# Altium schematic sheet Logic.SchDoc
size A
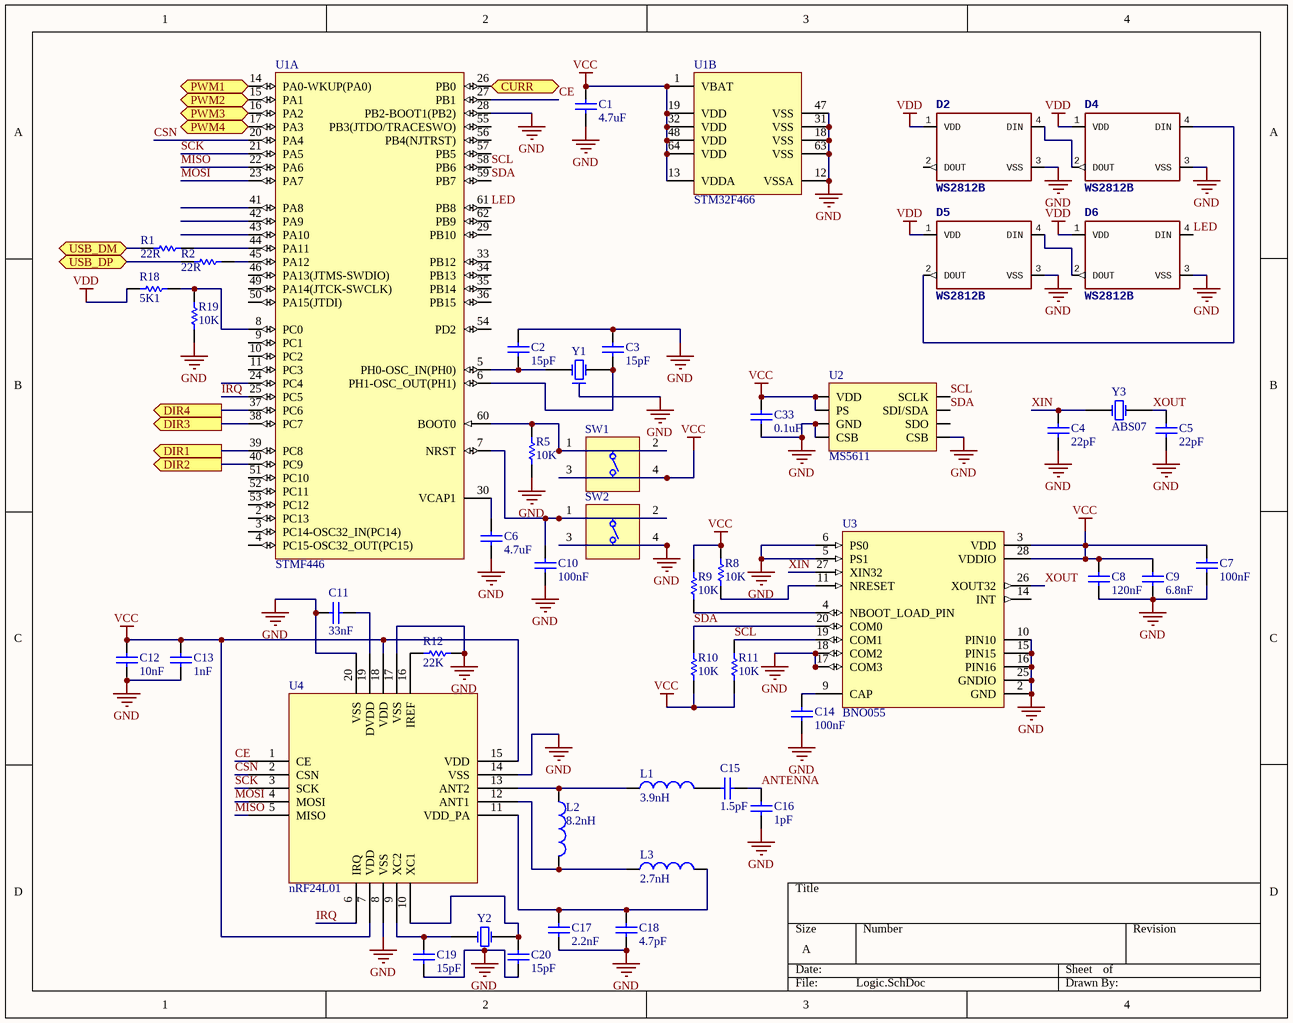
[diagram p0: Logic.SchDoc]

## Parts
C1  4.7uF  [CAPC0402(1005)60_L]
C2  15pF  [CAPC0402(1005)60_M]
C3  15pF  [CAPC0402(1005)60_M]
C4  22pF  [CAPC0402(1005)60_L]
C5  22pF  [CAPC0402(1005)60_L]
C6  4.7uF  [CAPC0402(1005)60_L]
C7  100nF  [CAPC0402(1005)60_M]
C8  120nF  [CAPC0402(1005)60_M]
C9  6.8nF  [CAPC0402(1005)60_L]
C10  100nF  [CAPC0402(1005)60_M]
C11  33nF  [CAPC0402(1005)60_M]
C12  10nF  [CAPC0402(1005)60_M]
C13  1nF  [CAPC0402(1005)60_M]
C14  100nF  [CAPC0402(1005)60_M]
C15  1.5pF  [CAPC0402(1005)60_L]
C16  1pF  [CAPC0402(1005)60_M]
C17  2.2nF  [CAPC0402(1005)60_N]
C18  4.7pF  [CAPC0402(1005)60_M]
C19  15pF  [CAPC0402(1005)60_N]
C20  15pF  [CAPC0402(1005)60_N]
C33  0.1uF  [CAPC0402(1005)60_M]
D2  WS2812B  [WS2812B]
D4  WS2812B  [WS2812B]
D5  WS2812B  [WS2812B]
D6  WS2812B  [WS2812B]
L1  3.9nH  [INDC0402(1005)_N]
L2  8.2nH  [INDC0402(1005)_N]
L3  2.7nH  [INDC0402(1005)_N]
R1  22R  [RESC0402(1005)_M]
R2  22R  [RESC0402(1005)_M]
R5  10K  [RESC0402(1005)_N]
R8  10K  [RESC0402(1005)_N]
R9  10K  [RESC0402(1005)_N]
R10  10K  [RESC0402(1005)_N]
R11  10K  [RESC0402(1005)_N]
R12  22K  [RESC0402(1005)_L]
R18  5K1  [RESC0402(1005)_L]
R19  10K  [RESC0402(1005)_N]
SW1  (no value)  [SWITCH]
SW2  (no value)  [SWITCH]
U1  STMF446  [STM-LQFP64_N]  (parts A,B of 2)
U2  MS5611  [MS5611]
U3  BNO055  [LGA28R50P4X10_380X520X100]
U4  (no value)  [QFN20]
Y1  (no value)  [ABRA-ABM3B-4_V]
Y2  (no value)  [ABRA-ABM3B-4_V]
Y3  ABS07  [ABS07]

## Ports
CURR (in), DIR1 (out), DIR2 (out), DIR3 (out), DIR4 (out), PWM1 (out), PWM2 (out), PWM3 (out), PWM4 (out), USB_DM (bidir), USB_DP (bidir)

## Nets
GND: C1.1 C2.2 C3.2 C4.1 C5.1 C6.1 C7.1 C8.1 C9.1 C10.1 C11.1 C12.1 C13.1 C14.1 C16.1 C17.1 C18.1 C19.1 C20.1 C33.1 D2.3(VSS) D4.3(VSS) D5.3(VSS) D6.3(VSS) R5.1 R12.1 R19.1 SW2.3(T3) SW2.4(T3) U1.12(VSSA) U1.18(VSS) U1.28(PB2-BOOT1(PB2)) U1.31(VSS) U1.47(VSS) U1.63(VSS) U2.3(GND) U2.4(CSB) U2.5(CSB) U3.2(GND) U3.5(PS1) U3.6(PS0) U3.10(PIN10) U3.15(PIN15) U3.16(PIN16) U3.17(COM3) U3.18(COM2) U3.25(GNDIO) U4.8(VSS) U4.14(VSS) U4.17(VSS) U4.20(VSS) Y1.2 Y2.2
VCC: C1.2 C7.2 C8.2 C9.2 C12.2 C13.2 C33.2 R8.2 R9.2 R10.1 R11.1 SW1.3(T3) SW1.4(T3) U1.1(VBAT) U1.13(VDDA) U1.19(VDD) U1.32(VDD) U1.48(VDD) U1.64(VDD) U2.1(VDD) U2.2(PS) U3.3(VDD) U3.28(VDDIO) U4.7(VDD) U4.15(VDD) U4.18(VDD)
VDD: D2.1(VDD) D4.1(VDD) D5.1(VDD) D6.1(VDD) R18.2
ANTENNA: C15.2 C16.2
CE: U1.27(PB1) U4.1(CE)
CSN: U1.20(PA4) U4.2(CSN)
CURR: U1.26(PB0) ; port CURR
DIR1: U1.39(PC8) ; port DIR1
DIR2: U1.40(PC9) ; port DIR2
DIR3: U1.38(PC7) ; port DIR3
DIR4: U1.37(PC6) ; port DIR4
IRQ: U1.25(PC5) U4.6(IRQ)
LED: D6.4(DIN) U1.61(PB8)
MISO: U1.22(PA6) U4.5(MISO)
MOSI: U1.23(PA7) U4.4(MOSI)
PWM1: U1.14(PA0-WKUP(PA0)) ; port PWM1
PWM2: U1.15(PA1) ; port PWM2
PWM3: U1.16(PA2) ; port PWM3
PWM4: U1.17(PA3) ; port PWM4
SCK: U1.21(PA5) U4.3(SCK)
SCL: R11.2 U1.58(PB6) U2.8(SCLK) U3.19(COM1)
SDA: R10.2 U1.59(PB7) U2.7(SDI/SDA) U3.20(COM0)
USB_DM: R1.1 ; port USB_DM
USB_DP: R2.1 ; port USB_DP
XIN: C4.2 U3.27(XIN32) Y3.1(X1)
XOUT: C5.2 U3.26(XOUT32) Y3.2(X2)
NetC2_1: C2.1 U1.5(PH0-OSC_IN(PH0)) Y1.1(X1)
NetC3_1: C3.1 U1.6(PH1-OSC_OUT(PH1)) Y1.3(X2)
NetC6_2: C6.2 U1.30(VCAP1)
NetC10_2: C10.2 SW2.1(T1) SW2.2(T2) U1.7(NRST)
NetC11_2: C11.2 U4.19(DVDD)
NetC14_2: C14.2 U3.9(CAP)
NetC15_1: C15.1 L1.2
NetC17_2: C17.2 C18.2 L3.2 U4.11(VDD_PA)
NetC19_2: C19.2 U4.9(XC2) Y2.1(X1)
NetC20_2: C20.2 U4.10(XC1) Y2.3(X2)
NetD2_4: D2.4(DIN) D4.2(DOUT)
NetD4_4: D4.4(DIN) D5.2(DOUT)
NetD5_4: D5.4(DIN) D6.2(DOUT)
NetL1_1: L1.1 L2.1 U4.13(ANT2)
NetL2_2: L2.2 L3.1 U4.12(ANT1)
NetR1_2: R1.2 U1.44(PA11)
NetR2_2: R2.2 U1.45(PA12)
NetR5_2: R5.2 SW1.1(T1) SW1.2(T2) U1.60(BOOT0)
NetR8_1: R8.1 U3.11(NRESET)
NetR9_1: R9.1 U3.4(NBOOT_LOAD_PIN)
NetR12_2: R12.2 U4.16(IREF)
NetR18_1: R18.1 R19.2 U1.8(PC0)

Not connected (* = marked no-connect by the designer): D2 2(DOUT); U1 2(PC13) 3(PC14-OSC32_IN(PC14)) 4(PC15-OSC32_OUT(PC15)) 9(PC1) 10(PC2) 11(PC3) 24(PC4) 29(PB10) 33(PB12) 34(PB13) 35(PB14) 36(PB15) 41(PA8) 42(PA9) 43(PA10) 46(PA13(JTMS-SWDIO)) 49(PA14(JTCK-SWCLK)) 50(PA15(JTDI)) 51(PC10) 52(PC11) 53(PC12) 54(PD2) 55(PB3(JTDO/TRACESWO)) 56(PB4(NJTRST)) 57(PB5) 62(PB9); U2 6(SDO); U3 14(INT)

## Notes on the sheet
- (in symbol NRF24L01+) nRF24L01

## Library data of the parts
C1 C6 = CMP-1034-02136-1: CAP 4.7uF 6.3V ±10% 0402 (1005 Metric) Thickness 0.6mm SMD; Case-EIA: 0402; Tolerance: Â±10%; Case-Metric: 1005; Technology: SMT; Value: 4.7uF; Max Thickness: 0.6 mm; Rated Voltage: 6.3 V
C2 C3 = CMP-1034-00804-1: CAP 15pF 25V ±0.25pF 0402 (1005 Metric) Thickness 0.6mm SMD; Case-EIA: 0402; Tolerance: Â±0.25pF; Case-Metric: 1005; Rated Voltage: 25 V; Max Thickness: 0.6 mm; Value: 15pF; Technology: SMT
C4 C5 = CMP-1034-00911-1: CAP 22pF 25V ±10% 0402 (1005 Metric) Thickness 0.6mm SMD; Case-Metric: 1005; Case-EIA: 0402; Tolerance: Â±10%; Technology: SMT; Max Thickness: 0.6 mm; Rated Voltage: 25 V; Value: 22pF
C7 C8 C10 C14 C33 = CMP-1034-02060-1: CAP 100nF 6.3V ±5% 0402 (1005 Metric) Thickness 0.6mm SMD; Case-EIA: 0402; Tolerance: Â±5%; Case-Metric: 1005; Rated Voltage: 6.3 V; Max Thickness: 0.6 mm; Value: 100nF; Technology: SMT
C9 = CMP-1034-01836-1: CAP 6.8nF 6.3V ±5% 0402 (1005 Metric) Thickness 0.6mm SMD; Case-EIA: 0402; Tolerance: Â±5%; Case-Metric: 1005; Max Thickness: 0.6 mm; Rated Voltage: 6.3 V; Value: 6.8nF; Technology: SMT
C11 = CMP-1034-01977-1: CAP 33nF 6.3V ±10% 0402 (1005 Metric) Thickness 0.6mm SMD; Tolerance: Â±10%; Case-Metric: 1005; Case-EIA: 0402; Technology: SMT; Rated Voltage: 6.3 V; Max Thickness: 0.6 mm; Value: 33nF
C12 = CMP-1034-01867-1: CAP 10nF 6.3V ±5% 0402 (1005 Metric) Thickness 0.6mm SMD; Case-EIA: 0402; Case-Metric: 1005; Tolerance: Â±5%; Technology: SMT; Rated Voltage: 6.3 V; Max Thickness: 0.6 mm; Value: 10nF
C13 = CMP-1034-01609-1: CAP 1nF 6.3V ±5% 0402 (1005 Metric) Thickness 0.6mm SMD; Case-EIA: 0402; Tolerance: Â±5%; Case-Metric: 1005; Rated Voltage: 6.3 V; Value: 1nF; Technology: SMT; Max Thickness: 0.6 mm
C15 = CMP-1034-00110-1: CAP 1.5pF 25V ±0.5pF 0402 (1005 Metric) Thickness 0.6mm SMD; Case-EIA: 0402; Case-Metric: 1005; Tolerance: Â±0.5pF; Max Thickness: 0.6 mm; Technology: SMT; Value: 1.5pF; Rated Voltage: 25 V
C16 = CMP-1034-00055-1: CAP 1pF 25V ±0.5pF 0402 (1005 Metric) Thickness 0.6mm SMD; Case-Metric: 1005; Tolerance: Â±0.5pF; Case-EIA: 0402; Value: 1pF; Rated Voltage: 25 V; Technology: SMT; Max Thickness: 0.6 mm
C17 = CMP-1034-01722-1: CAP 2.2nF 6.3V ±5% 0402 (1005 Metric) Thickness 0.6mm SMD; Tolerance: Â±5%; Case-EIA: 0402; Case-Metric: 1005; Max Thickness: 0.6 mm; Technology: SMT; Rated Voltage: 6.3 V; Value: 2.2nF
C18 = CMP-1034-00362-1: CAP 4.7pF 25V ±0.1pF 0402 (1005 Metric) Thickness 0.6mm SMD; Case-EIA: 0402; Case-Metric: 1005; Tolerance: Â±0.1pF; Max Thickness: 0.6 mm; Value: 4.7pF; Technology: SMT; Rated Voltage: 25 V
C19 C20 = CMP-1034-00809-1: CAP 15pF 25V ±10% 0402 (1005 Metric) Thickness 0.6mm SMD; Tolerance: Â±10%; Case-Metric: 1005; Case-EIA: 0402; Rated Voltage: 25 V; Value: 15pF; Max Thickness: 0.6 mm; Technology: SMT
D2 D4-D6 = WS2812B: PROD_ID: DIO-12503
L1-L3 = INDC0402: Inductor; Code_IEC: 1005; Published: 8-Jun-2000; LatestRevisionDate: 29-May-2009; LatestRevisionNote: IPC-7351 Footprint Added.; PackageReference: 0402-A; Publisher: Altium Limited; PackageDescription: Chip Inductor; Code_JEITA: 0402
R1 R2 = CMP-1011-00034-1: 22R 0.063W 5% 0402 (1005 Metric)  SMD; Value: 22.00 Ohm; Case-EIA: 0402; Case-Metric: 1005; Power: 0.063 W; Tolerance: 5 %; Technology: SMT
R5 R8-R11 R19 = CMP-1011-00098-1: 10K 0.063W 5% 0402 (1005 Metric)  SMD; Case-Metric: 1005; Value: 10000.00 Ohm; Case-EIA: 0402; Technology: SMT; Tolerance: 5 %; Power: 0.063 W
R12 = CMP-1011-00106-1: 22K 0.063W 5% 0402 (1005 Metric)  SMD; Case-Metric: 1005; Value: 22000.00 Ohm; Case-EIA: 0402; Tolerance: 5 %; Technology: SMT; Power: 0.063 W
R18 = CMP-1011-00091-1: 5K1 0.063W 5% 0402 (1005 Metric)  SMD; Case-EIA: 0402; Value: 5100.00 Ohm; Case-Metric: 1005; Technology: SMT; Tolerance: 5 %; Power: 0.063 W
SW1 SW2 = DIPT-DTSM-6: Switch, SPNO Push Button SMD; Manufacturer: Diptronics; PartNumber: DTSM-61NT/R; Packing Type: Tape&Reel; Mechanical Life: 200,000 cycles; ComponentLink2URL: http://www.dip.com.tw/Products_tact.htm; ComponentLink1URL: http://www.dip.com.tw/; ComponentLink3URL: http://www.dip.com.tw/PDF/pro_tact/DTSM_G_-6_2_-V.pdf; PackageDescription: Switch, Through-Hole, 4 Leads, Body 8.5x8.5mm, Row Spacing 9.0mm, Pitch 4.5mm; ComponentLink2Description: Datasheet; ComponentLink3Description: Package Specification; ComponentLink1Description: Manufacturer URL; PackageReference: DTSM-6; Mounting Technology: Through Hole
U1 = MC-ARM-STM32F4X5-SQ64
U4 = NRF24L01+: Part Field 1: 0603
Y1 Y2 = ABRA-ABM3B-4
U3 = BNO055: Value: *